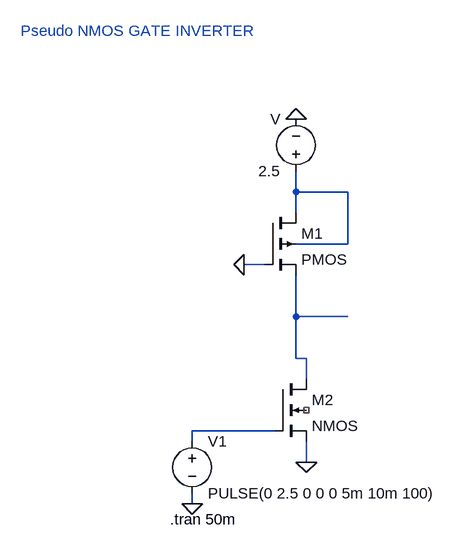
[diagram p0: schematic PSEUDO NMOS INVERTER.asc]
PSEUDO NMOS INVERTER.asc, the LTspice schematic file:
Version 4
SHEET 1 880 680
WIRE 240 48 240 16
WIRE 320 48 240 48
WIRE 240 80 240 48
WIRE 320 128 320 48
WIRE 320 128 240 128
WIRE 192 160 160 160
WIRE 240 240 240 176
WIRE 320 240 240 240
WIRE 240 304 240 240
WIRE 256 304 240 304
WIRE 256 336 256 304
WIRE 208 416 80 416
WIRE 80 432 80 416
WIRE 256 464 256 432
WIRE 80 528 80 512
FLAG 256 464 0
FLAG 160 160 0
FLAG 240 -64 0
FLAG 80 528 0
SYMBOL pmos4 192 80 R0
SYMATTR InstName M1
SYMBOL nmos4 208 336 R0
SYMATTR InstName M2
SYMBOL voltage 240 32 R180
WINDOW 0 24 96 Left 2
WINDOW 3 24 16 Left 2
SYMATTR InstName V
SYMATTR Value 2.5
SYMBOL voltage 80 416 R0
WINDOW 123 0 0 Left 0
WINDOW 39 0 0 Left 0
SYMATTR InstName V1
SYMATTR Value PULSE(0 2.5 0 0 0 5m 10m 100)
TEXT 46 552 Left 2 !.tran 50m
TEXT -184 -200 Left 2 ;Pseudo NMOS GATE INVERTER

The netlist it stands for:
* PSEUDO NMOS INVERTER.asc
M1 N001 0 N002 N001 PMOS
M2 N002 N003 0 NC_01 NMOS
V N001 0 2.5
V1 N003 0 PULSE(0 2.5 0 0 0 5m 10m 100)
.model NMOS NMOS
.model PMOS PMOS
.lib standard.mos
.tran 50m
* Pseudo NMOS GATE INVERTER
.backanno
.end